# Altium schematic sheet Peripheral.SchDoc
size A4; SheetNumber: 3; SheetTotal: 3
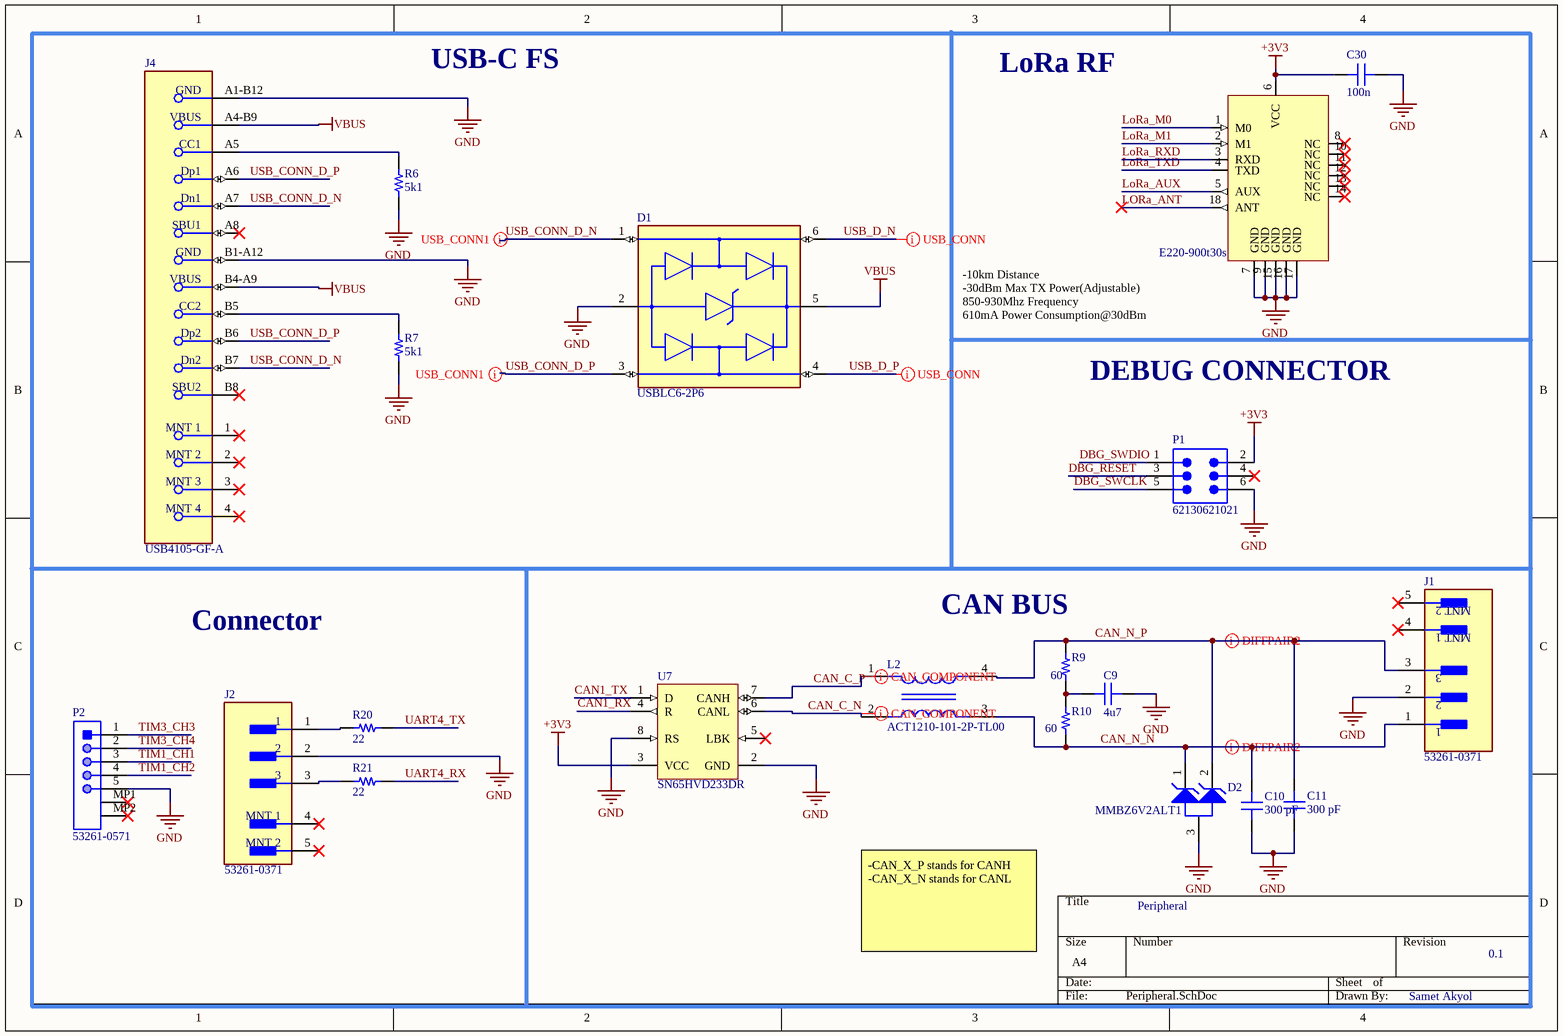
[diagram p0: Peripheral.SchDoc]

## Parts
C9  4u7  [CAP 0603_1608]
C10  300 pF  [CAP 0402_1005]
C11  300 pF  [CAP 0402_1005]
C30  100n  [CAP 0603_1608]
D1  USBLC6-2P6  [FP-SOT-666-MFG]
D2  MMBZ6V2ALT1  [ONSC-SOT-23-3-318-08_V]
J1  53261-0371  [FP-53261-0371-MFG]
J2  53261-0371  [FP-53261-0371-MFG]
J4  USB4105-GF-A  [FP-USB4105-GF-A-MFG]
L2  ACT1210-101-2P-TL00  [FP-ACT1210-MFG]
P1  62130621021  [62130621021]
P2  53261-0571  [MOLX-52361-0571-5_V]
R6  5k1  [RES 0402_1005]
R7  5k1  [RES 0402_1005]
R9  60  [RES 0603_1608]
R10  60  [RES 0603_1608]
R20  22  [RES 0603_1608]
R21  22  [RES 0603_1608]
U7  SN65HVD233DR  [D0008A_M]
U31  Comment  [PE220-900T30S]  (value not drawn)  (parts A,B of 2)

## Nets
+3V3: C30.1 P1.2 U7.3(VCC) U31.6(VCC)
GND: C9.2 C10.1 C11.1 C30.2 D1.2(GND) D2.3(A) J1.2 J2.2 J4.A1-B12(GND) J4.B1-A12(GND) P1.6 P2.5 R6.1 R7.1 U7.2(GND) U7.8(RS) U31.7(GND) U31.9(GND) U31.15(GND) U31.16(GND) U31.17(GND)
VBUS: D1.5(VBUS) J4.A4-B9(VBUS) J4.B4-A9(VBUS)
CAN1_RX: U7.4(R)
CAN1_TX: U7.1(D)
CAN_C_N: L2.2 U7.6(CANL)
CAN_C_P: L2.1 U7.7(CANH)
CAN_N_N: C10.2 D2.1(K1) J1.1 L2.3 R10.1
CAN_N_P: C11.2 D2.2(K2) J1.3 L2.4 R9.2
DBG_RESET: P1.3
DBG_SWCLK: P1.5
DBG_SWDIO: P1.1
LORa_ANT: U31.18(ANT)
LoRa_AUX: U31.5(AUX)
LoRa_M0: U31.1(M0)
LoRa_M1: U31.2(M1)
LoRa_RXD: U31.3(RXD)
LoRa_TXD: U31.4(TXD)
TIM1_CH1: P2.3
TIM1_CH2: P2.4
TIM3_CH3: P2.1
TIM3_CH4: P2.2
UART4_RX: R21.1
UART4_TX: R20.1
USB_CONN_D_N: D1.1(I/O1) J4.A7(Dn1) J4.B7(Dn2)
USB_CONN_D_P: D1.3(I/O2) J4.A6(Dp1) J4.B6(Dp2)
USB_D_N: D1.6(I/O1)
USB_D_P: D1.4(I/O2)
NetC9_1: C9.1 R9.1 R10.2
NetJ2_1: J2.1 R20.2
NetJ2_3: J2.3 R21.2
NetJ4_A5: J4.A5(CC1) R6.2
NetJ4_B5: J4.B5(CC2) R7.2

Not connected (* = marked no-connect by the designer): J1 4(MNT_1)* 5(MNT_2)*; J2 4(MNT_1)* 5(MNT_2)*; J4 1(MNT_1)* 2(MNT_2)* 3(MNT_3)* 4(MNT_4)* A8(SBU1)* B8(SBU2)*; P1 4*; P2 MP1* MP2*; U7 5(LBK)*; U31 8(NC)* 10(NC)* 11(NC)* 12(NC)* 13(NC)* 14(NC)*

## Layout directives
differential pair: CAN_C_N, CAN_C_P, CAN_N_P, USB_CONN_D_N, USB_CONN_D_P, USB_D_N, USB_D_P

## Notes on the sheet
- USB-C FS
- LoRa RF
- -10km Distance
  -30dBm Max TX Power(Adjustable)
  850-930Mhz Frequency
  610mA Power Consumption@30dBm
- DEBUG CONNECTOR
- Connector
- CAN BUS
- Peripheral
- -CAN_X_P stands for CANH
  -CAN_X_N stands for CANL
- 0.1
- Samet Akyol

## Library data of the parts
C9 = CL10A475KA8NQNC: CAP CER 4.7UF 25V X5R 0603; manufacturer: Samsung Electro-Mechanics; Capacitance: 4.7 µF; Tolerance: ±10%; Part Number: CL10A475KA8NQNC; Value: 4u7; Applications: General Purpose; componentlink1description: Datasheet; componentlink1url: http://www.samsungsem.com/kr/support/product-search/mlcc/CL10A475KA8NQNC.jsp; componentlink2description: DigiKey Link; componentlink2url: https://www.digikey.com/en/products/detail/samsung-electro-mechanics/CL10A475KA8NQNC/3887558; Device Package: 0603 (1608 Metric); lastupdated: 9.02.2024 20:10:30; Lifecycle Status: Active; Minimum Order: 1; Mounting Type: Surface Mount, MLCC; Operating Temperature: -55°C ~ 85°C; Package / Case: 0603 (1608 Metric); packaging: TapeAndReel; partid: 2349; Part Status: Active; price: 0.06; series: CL; Size / Dimension: 0.063" L x 0.031" W (1.60mm x 0.80mm); Supplier 1: DigiKey; Supplier Part Number 1: 1276-1900-1-ND; Temperature Coefficient: X5R; Thickness (Max): 0.035" (0.90mm); Voltage - Rated: 25V
C10 C11 = C0402C301J3GAC7867: CAP CER 300PF 25V C0G/NP0 0402; manufacturer: KEMET; Temperature Coefficient: C0G, NP0; Tolerance: ±5%; Part Number: C0402C301J3GAC7867; Value: 300 pF; Applications: General Purpose; Capacitance: 300 pF; componentlink1description: Datasheet; componentlink1url: https://api.kemet.com/component-edge/download/datasheet/C0402C301J3GAC7867.pdf; componentlink2description: DigiKey Link; componentlink2url: https://www.digikey.com/en/products/detail/kemet/C0402C301J3GAC7867/7382019; Device Package: 0402 (1005 Metric); Features: Low ESL; lastupdated: 9.02.2024 20:04:37; Lifecycle Status: Active; Minimum Order: 1; Mounting Type: Surface Mount, MLCC; Operating Temperature: -55°C ~ 125°C; Package / Case: 0402 (1005 Metric); packaging: TapeAndReel; partid: 2000; Part Status: Active; price: 0.09; series: SMD Comm C0G; Size / Dimension: 0.039" L x 0.020" W (1.00mm x 0.50mm); Supplier 1: DigiKey; Supplier Part Number 1: 399-14903-1-ND; Thickness (Max): 0.022" (0.55mm); Voltage - Rated: 25V
C30 = 100X14W104MV4T: CAP CER 0.1UF 10V X7R 0603; manufacturer: Johanson Dielectrics Inc.; Capacitance: 0.1 µF; Tolerance: ±20%; Part Number: 100X14W104MV4T; Value: 100n; Applications: Bypass, Decoupling; componentlink1description: Datasheet; componentlink1url: https://www.johansondielectrics.com/downloads/x2y-filter-and-decoupling-capacitors.pdf; componentlink2description: DigiKey Link; componentlink2url: https://www.digikey.com/en/products/detail/johanson-dielectrics-inc/100X14W104MV4T/1655914; Device Package: 0603 (1608 Metric); Features: Low ESL (X2Y); lastupdated: 9.02.2024 20:10:30; Lifecycle Status: Active; Minimum Order: 1; Mounting Type: Surface Mount, MLCC; Operating Temperature: -55°C ~ 125°C; Package / Case: 0603 (1608 Metric); packaging: TapeAndReel; partid: 2680; Part Status: Active; price: 0.08; series: X2Y®; Size / Dimension: 0.064" L x 0.035" W (1.63mm x 0.89mm); Supplier 1: DigiKey; Supplier Part Number 1: 709-1101-1-ND; Temperature Coefficient: X7R; Thickness (Max): 0.026" (0.66mm); Voltage - Rated: 10V
D1 = CMP-12225-000058-1: TVS DIODE 5.25V 17V SOT666; Min Breakdown Voltage: 6V; Power Line Protection: Yes; Element Configuration: Dual; Test Current: 1mA; Working Voltage: 5V; Number of Channels: 2; Max Reverse Leakage Current: 150nA; Direction: Unidirectional; Peak Pulse Current: 5A; Number of Elements: 1; Capacitance: 3.5pF; Max Breakdown Voltage: 6V; Height: 0.6mm; Depth: 1.3mm; Contact Plating: Tin; Reverse Breakdown Voltage: 6V; REACH SVHC: No SVHC; Operating Supply Voltage: 5V; Width: 1.3mm; Max Operating Temperature: 125°C; Reverse Standoff Voltage: 5V; ESD Protection: Yes; Package Quantity: 1; Termination: SMD/SMT; Length: 1.7mm; Leakage Current: 150nA; Number of Bidirectional Channels: 2; Case/Package: SOT-666; Min Operating Temperature: -40°C; Number of Pins: 6; Clamping Voltage: 17V; Breakdown Voltage: 6V; Lead Free: Lead Free; Radiation Hardening: No; Packaging: Tape and Reel; Mount: Surface Mount; Polarity: Unidirectional
D2 = CMP-1060-01252-1: 24 W Peak Power Zener Transient Voltage Suppressor, Dual Common Anode Zeners for ESD Protection, 3-Pin SOT-23, Tape and Reel; Manufacturer: On Semiconductor; VZ Typ (V): 6.2; PackageVersion: Rev. AP, 11/2009; PackageReference: SOT-23-3-318-08; Mounting Technology: Surface Mount; ComponentLink3URL: http://www.onsemi.cn/pub_link/Collateral/318-08.PDF; ComponentLink1URL: http://www.onsemi.com/; ComponentLink2URL: http://www.onsemi.cn/pub_link/Collateral/MMBZ5V6ALT1-D.PDF; PartNumber: MMBZ6V2ALT1; Packing: Tape and Reel; ComponentLink1Description: Manufacturer URL; DatasheetVersion: Rev. 13; ComponentLink2Description: Datasheet; PackageDescription: 3-Pin Small Outline Transistor, Body 2.92 x 1.3 mm, Pitch 0.95 mm; ComponentLink3Description: Package Specification
J1 J2 = CMP-04776-000071-1: CONN HEADER SMD R/A 3POS 1.25MM; Manufacturer: Molex; Number Of Contacts: 3; Conn Orientation: Right Angle; Current Rating: 1A; Voltage Rating: 125V; Conn Gender: Male; Category: Conn; Automotive: No; Footprint Url: https://www.molex.com/pdm_docs/sd/532610371_sd.pdf; Height: 3.6mm; Number Of Rows: 1; Temperature Range Low: -40°C; Package: 0; Octopart: https://octopart.com/53261-0371-molex-655314; ComponentLink2Description: Datasheet; Lead Free: Yes; Ambient Temperature Range Low: -40°C; Device Class L3: unset; Mouser Description: 1.25mm (.049") Pitch PicoBlade Header, Surface Mount, Right Angle, Lead-free, 3 Circuits; Digikey Description: CONN HEADER SMD R/A 3POS 1.25MM; Device Class L2: Headers and Wire Housings; Contact Material: Tin,Nickel; Manufacturer Part Number: 53261-0371; Ambient Temperature Range High: +105°C; ComponentLink2URL: https://www.molex.com/webdocs/datasheets/pdf/en-us/0532610371_PCB_HEADERS.pdf; Pitch: 1.25mm; Temperature: -40°C to +105°C; RoHS: TRUE; Device Class L1: Connectors; Temperature Range High: +105°C
J4 = CMP-245163-000001-1: CONN RCPT USB2.0 TYPEC 5A; Manufacturer: GCT; Voltage Rating: 20V; Is Female: yes; Current Rating: 5/6.25/1.25/0.25A; Number Of Contacts: 16; Conn Orientation: Right Angle; Device Class L1: Connectors; Category: Conn; Lead Free: Yes; RoHS: TRUE; Temperature Range High: +85°C; Digikey Description: CONN RCPT USB2.0 TYPEC 5A; Device Class L3: unset; ComponentLink2Description: Datasheet; Manufacturer Part Number: USB4105-GF-A; Package: 0; Usb Standard: USB 2.0; Device Class L2: USB Connectors; Automotive: No; Temperature Range Low: -40°C; Height: 3.46mm; Temperature: -40°C to +85°C; Contact Material: Gold,Nickel; ComponentLink2URL: https://gct.co/files/drawings/usb4105.pdf; Octopart: https://octopart.com/usb4105-gf-a-gct-106627878
L2 = CMP-08256-000017-1: CMC 100UH 150MA 2LN SMD AEC-Q200; Shielding: Unshielded; DC Resistance (DCR): 1.5R; Test Frequency: 10MHz; Number of Lines: 2; Voltage Rating (DC): 80V; Impedance: 5.1kR; Tolerance: 50%; Length: 0.154inch; Mount: Surface Mount; Height: 0.098inch; Termination: SMD/SMT; Package Quantity: 6000; Max Current Rating: 150mA; REACH SVHC: No SVHC; Weight: 0.000564oz; Case/Package: 1210; Current Rating: 150mA; Packaging: Tape and Reel; Min Operating Temperature: -55°C; Ratings: AEC-Q200; Width: 0.098inch; Max Operating Temperature: 150°C; Depth: 2.5mm; Lead Free: Lead Free; RoHS Compliant: Yes; Max DC Current: 150mA; Inductance: 100uH
P1 = CMP-1502-00936-2: NexarPartId: 116077963
P2 = CMP-2000-05249-1: Male Header, Pitch 1.25 mm, 1 x 5 Position, Height 3.4 mm, RoHS, Tape and Reel; Brand: Molex; Mounting Angle: Right; Number of Positions: 5; Voltage Rating: 125V; Current Rating: 1A; Pitch: 1.25mm; Datasheet Version: Rev. D, 04/2004; Housing Material: Thermoplastic; Series: 53261; RoHS: Details; Product Category: Headers&WireHousings; Datasheet URL: http://datasheet.octopart.com/532610571-Molex-datasheet-8343080.pdf; Manufacturer URL: http://www.molex.com/; Contact Material: PhosphorBronze; Tradename: PicoBlade; Number of Rows: 1; Product Type: Headers; Manufacturer: Molex; Type: Shrouded; Termination Style: SMD; Mounting Style: SMD/SMT; Factory Pack Quantity: 1000; Contact Plating: Tin; Packaging: Reel; Number of Positions / Contacts: 5
R6 R7 = RT0402BRE075K11L: RES SMD 5.11KOHM 0.1% 1/16W 0402; Manufacturer: Yageo; Power (Watts): 0.063W, 1/16W; Resistance: 5.11 kOhms; Temperature Coefficient: ±50ppm/°C; Part Number: RT0402BRE075K11L; Value: 5k1; ComponentLink1Description: Datasheet; ComponentLink1URL: https://www.yageo.com/upload/media/product/productsearch/datasheet/rchip/PYu-RT_1-to-0.01_RoHS_L_11.pdf; ComponentLink2Description: DigiKey Link; ComponentLink2URL: https://www.digikey.com/en/products/detail/yageo/RT0402BRE075K11L/1069791; Composition: Thin Film; Device Package: 0402 (1005 Metric); Height - Seated (Max): 0.014" (0.35mm); LastUpdated: 9.02.2024 20:30:18; Lifecycle Status: Active; Minimum Order: 1; Number of Terminations: 2; Operating Temperature: -55°C ~ 155°C; Package / Case: 0402 (1005 Metric); Packaging: TapeAndReel; PartId: 3971; Part Status: Active; Price: 0.04; Series: RT; Size / Dimension: 0.039" L x 0.020" W (1.00mm x 0.50mm); Supplier 1: DigiKey; Supplier Part Number 1: YAG4403CT-ND; Supplier Device Package: 0402; Tolerance: ±0.1%
R9 R10 R20 R21 = CR0603-FX-60R4ELF: RES SMD 60.4 OHM 1% 1/10W 0603; Manufacturer: Bourns Inc.; Power (Watts): 0.1W, 1/10W; Resistance: 60.4 Ohms; Temperature Coefficient: ±100ppm/°C; Part Number: CR0603-FX-60R4ELF; ComponentLink1Description: Datasheet; ComponentLink1URL: https://www.bourns.com/docs/Product-Datasheets/CHPREZTR.pdf; ComponentLink2Description: DigiKey Link; ComponentLink2URL: https://www.digikey.com/en/products/detail/bourns-inc/CR0603-FX-60R4ELF/3784116; Composition: Thick Film; Device Package: 0603 (1608 Metric); Features: Moisture Resistant; Height - Seated (Max): 0.022" (0.55mm); LastUpdated: 9.02.2024 20:43:23; Lifecycle Status: Active; Minimum Order: 1; Number of Terminations: 2; Operating Temperature: -55°C ~ 155°C; Package / Case: 0603 (1608 Metric); Packaging: CutTape; PartId: 8152; Part Status: Active; Price: 0.01; Series: CR0603; Size / Dimension: 0.063" L x 0.031" W (1.60mm x 0.80mm); Supplier 1: DigiKey; Supplier Part Number 1: CR0603-FX-60R4ELFCT-ND; Supplier Device Package: 0603; Tolerance: ±1%
  R9 R10: Value: 60
  R20 R21: Value: 22
U7 = CMP-0315-00038-2: 3.3V CAN Transceiver with Standby Mode, Loop-back, 6 mA, -40 to 125 degC, 8-pin SOIC (D), Green (RoHS & no Sb/Br); Manufacturer: Texas Instruments; Rating: Catalog; ICC(Max)(mA): 6; Receivers Per Package: 1; Supply Voltage(s)(V): 3.3; Transient Pulse Protection(V): -100 to 100; Bus Fault Voltage(V): +/-30; Footprint: PCA82C250, excludes pin5; Code_JEDEC: MS-012AA; PackageVersion: revM, Jun-2011; ComponentLink1Description: Datasheet; Mounting Technology: Surface Mount; SubFamily: CAN; DatasheetVersion: SLLS557F; PartNumber: SN65HVD233DR; PackageReference: D0008A; Drivers Per Package: 1; ComponentLink1URL: http://www.ti.com/general/docs/lit/getliterature.tsp?genericPartNumber=SN65HVD233&fileType=pdf; PackageDescription: 8-Pin Plastic Small Outline Integrated Circuit, 4.9 x 3.9 mm, Pitch 1.27 mm Pitch; Eco-Plan: Green (RoHS & no Sb/Br); Features: Loop Back; Low Power Mode: Standby; Isolated: No
U31 = E220-900